# Altium project Схема подключения кнопки.PrjPcb
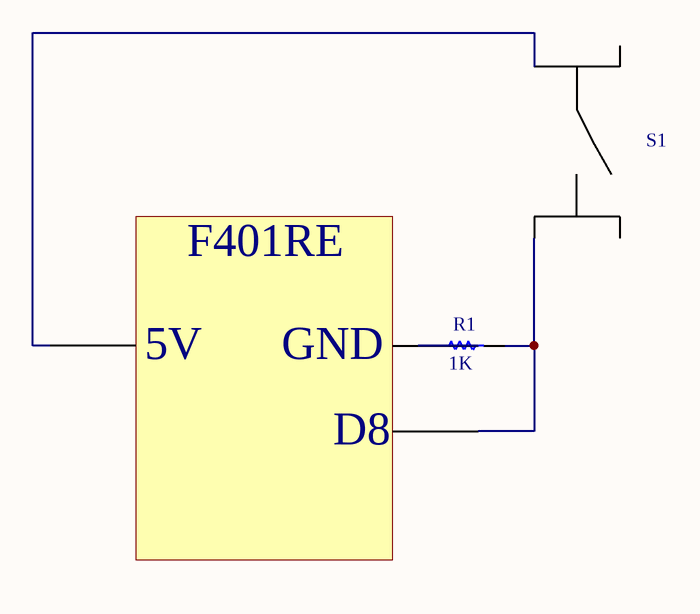
[diagram p0: Sheet1.SchDoc]
1 sheet, 3 parts. Net scope: global (net labels, ports and power ports of the same name join across sheets).

## Sheet Sheet1.SchDoc
size A4; SheetNumber: 1; SheetTotal: 1

### Parts
?  (no value)
R1  value 1K  (hidden comment: Resistor)
S1  (no value)  [Model Name]

### Nets
Net?_5: ?.5 S1.1
Net?_6: ?.6 R1.1
Net?_7: ?.7 R1.2 S1.4

Not connected (* = marked no-connect by the designer): S1 2 3

### Notes on the sheet
- (in symbol F401RE) 5V; GND; D8

### Library data of the parts
? = F401RE
R1 = Resistor: TC1: 0; SimulationGenericComponent: True; TC2: 0
S1 = But